# Altium project bms_mainboard-1_0.PrjPcb (part 7 of 7)

## Sheet gnss_quectel_lc29hea.SchDoc
size A
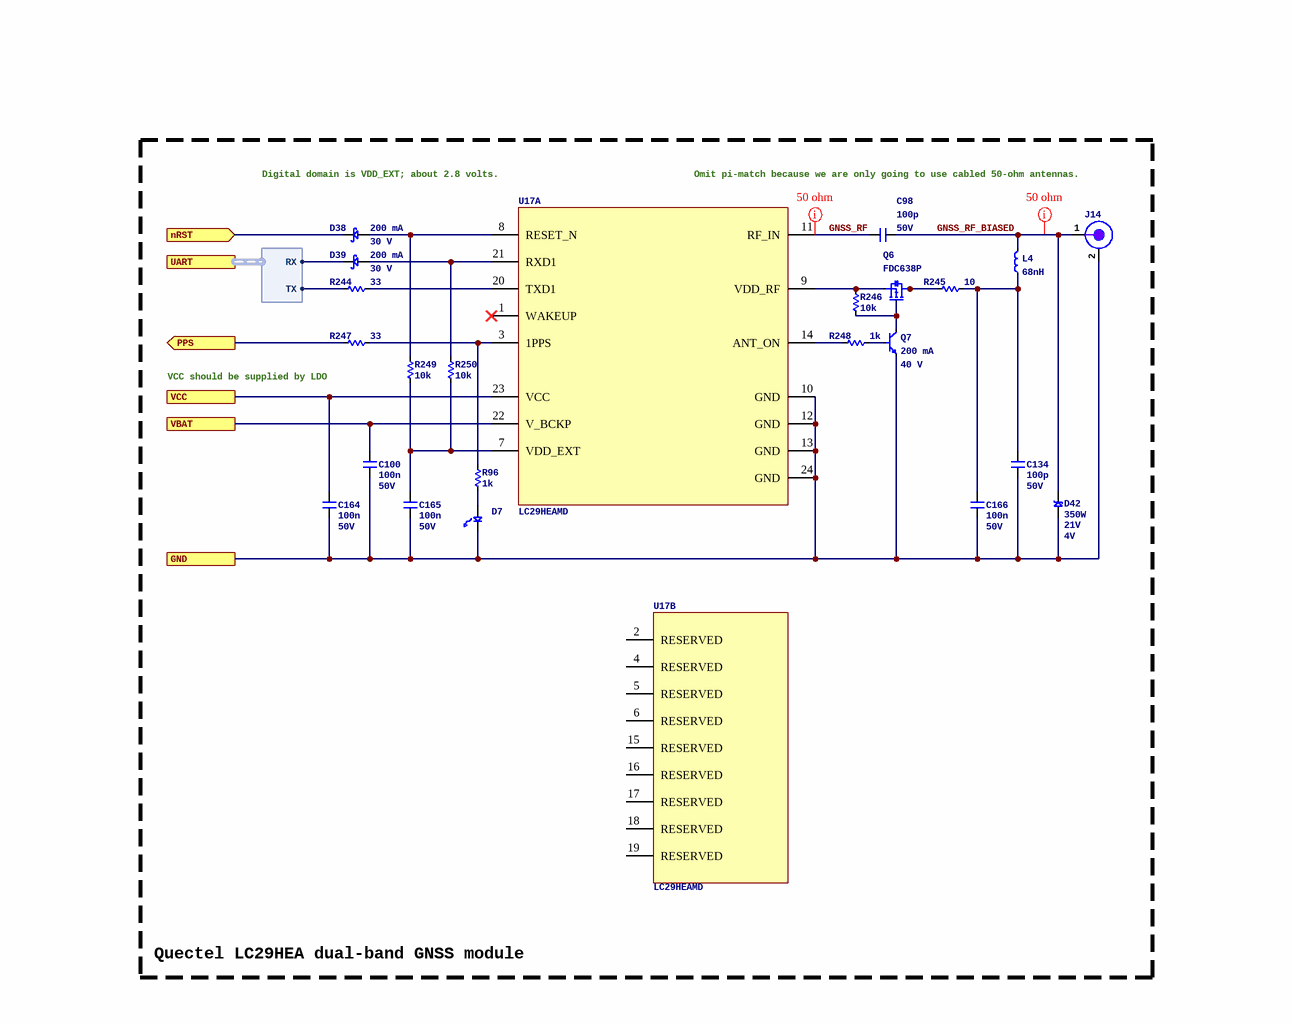
[diagram p32: gnss_quectel_lc29hea.SchDoc]

### Parts
C98  Capacitance: 100p  Voltage Rating: 50V  [C0402]  (hidden comment: 0402CG101J500NT)
C100  Capacitance: 100n  Voltage Rating: 50V  [C0402]  (hidden comment: CL05B104KB54PNC)
C134  Capacitance: 100p  Voltage Rating: 50V  [C0402]  (hidden comment: 0402CG101J500NT)
C164  Capacitance: 100n  Voltage Rating: 50V  [C0402]  (hidden comment: CL05B104KB54PNC)
C165  Capacitance: 100n  Voltage Rating: 50V  [C0402]  (hidden comment: CL05B104KB54PNC)
C166  Capacitance: 100n  Voltage Rating: 50V  [C0402]  (hidden comment: CL05B104KB54PNC)
D7  LTST-C191TBKT  [LED_0603P_BLUE]  (value not drawn)
D38  Current: 200 mA  Voltage: 30 V  [SOD523]  (hidden comment: BAT54XV2T1G)
D39  Current: 200 mA  Voltage: 30 V  [SOD523]  (hidden comment: BAT54XV2T1G)
D42  Non-rep Peak Rev Power Dis-Max: 350W  Clamping Voltage-Max: 21V  Min Breakdown Voltage: 4V  [SOD323]  (hidden comment: PTVSLC3D3V3B)
J14  RFPC-SMA14-FN-A  [GCT_RFPC-SMA14-FN-A]  (value not drawn)
L4  value 68nH  [L0603_0.95MM]  (hidden comment: LQW18AN68NJ80D)
Q6  FDC638P  [6SOT23]
Q7  Current: 200 mA  Voltage: 40 V  [3SOT523]  (hidden comment: MMBT3904T)
R96  value 1k  [R0402]  (hidden comment: 0402WGF1001TCE)
R244  value 33  [R0402]  (hidden comment: 0402WGF330JTCE)
R245  value 10  [R2512]  (hidden comment: RTT2510R0FTE)
R246  value 10k  [R0402]  (hidden comment: 0402WGF1002TCE)
R247  value 33  [R0402]  (hidden comment: 0402WGF330JTCE)
R248  value 1k  [R0402]  (hidden comment: 0402WGF1001TCE)
R249  value 10k  [R0402]  (hidden comment: 0402WGF1002TCE)
R250  value 10k  [R0402]  (hidden comment: 0402WGF1002TCE)
U17  LC29HEAMD  [QUECTEL_LC29H]  (parts A,B of 2)

### Ports
GND, nRST (in), PPS (out), UART (harness UART), VBAT, VCC

### Harnesses
UART: RX, TX

### Nets
GND: C100.2 C134.2 C164.2 C165.2 C166.2 D7.1 D42.1 J14.2(GND) Q7.2(E) U17.10(GND) U17.12(GND) U17.13(GND) U17.24(GND) ; port GND
VBAT: C100.1 U17.22(V_BCKP) ; port VBAT
3P3_GNSS: C164.1 U17.23(VCC) ; port VCC
GNSS_nRST: D38.2 ; port nRST
GNSS_RF: C98.1 U17.11(RF_IN)
GNSS_RF_BIASED: C98.2 D42.2 J14.1(RF) L4.2
TIMEPULSE: R247.2 ; port PPS
UART8.RX: R244.2 ; port UART.TX
UART8.TX: D39.2 ; port UART.RX
NetC134_1: C134.1 C166.1 L4.1 R245.1
NetC165_1: C165.1 R249.2 R250.2 U17.7(VDD_EXT)
NetD7_2: D7.2 R96.2
NetD38_1: D38.1 R249.1 U17.8(RESET_N)
NetD39_1: D39.1 R250.1 U17.21(RXD1)
NetQ6_1: Q6.1 Q6.2 Q6.5 Q6.6 R245.2
NetQ6_3: Q6.3 Q7.3(C) R246.2
NetQ6_4: Q6.4 R246.1 U17.9(VDD_RF)
NetQ7_1: Q7.1(B) R248.1
NetR96_1: R96.1 R247.1 U17.3(1PPS)
NetR244_1: R244.1 U17.20(TXD1)
NetR248_2: R248.2 U17.14(ANT_ON)

Not connected (* = marked no-connect by the designer): U17 1(WAKEUP)* 2(RESERVED) 4(RESERVED) 5(RESERVED) 6(RESERVED) 15(RESERVED) 16(RESERVED) 17(RESERVED) 18(RESERVED) 19(RESERVED)

### Layout directives
net class SE_50: GNSS_RF, GNSS_RF_BIASED

### Notes on the sheet
- Digital domain is VDD_EXT; about 2.8 volts.
- Omit pi-match because we are only going to use cabled 50-ohm antennas.
- (near R247) VCC should be supplied by LDO
- Quectel LC29HEA dual-band GNSS module

### Library data of the parts
C98 C134 = 0402CG101J500NT: Manufacturer: FH(Guangdong Fenghua Advanced Tech); Dielectric: C0G; ComponentLink1URL: https://wmsc.lcsc.com/wmsc/upload/file/pdf/v2/lcsc/2304140030_FH--Guangdong-Fenghua-Advanced-Tech-0402CG101J500NT_C1546.pdf; ComponentLink1Description: Datasheet; Manufacturer Part Number: 0402CG101J500NT; Package: 0402; Supplier 2: LCSC; Supplier Part Number 2: C1546
C100 C164-C166 = CL05B104KB54PNC: Manufacturer: Samsung Electro-Mechanics; Dielectric: X7R; ComponentLink1URL: https://wmsc.lcsc.com/wmsc/upload/file/pdf/v2/lcsc/2304140030_Samsung-Electro-Mechanics-CL05B104KB54PNC_C307331.pdf; ComponentLink1Description: Datasheet; Manufacturer Part Number: CL05B104KB54PNC; Package: 0402; Supplier 2: LCSC; Supplier Part Number 2: C307331
D7 = LED_0603_BLUE_LTST-C191TBKT: LED 468NM BLUE CLEAR 0603 SMD; Manufacturer: Lite-On Inc; Supplier 1: Digikey; Manufacturer Part Number: LTST-C191TBKT; ComponentLink1URL: https://mm.digikey.com/Volume0/opasdata/d220001/medias/docus/1139/LTST-C190AKT.pdf; ComponentLink1Description: Datasheet; Supplier Part Number 1: 160-1647-1-ND; Supplier 2: LCSC; Supplier Part Number 2: C99290
D38 D39 = SCHOTTKY_30V_BAT54XV2T1G: ON Semi BAT54XV2T1G; SMT Schottky Diode; 30V 200mA; 5ns; 2-Pin SOD-523; Manufacturer: onsemi; Supplier 1: DigiKey; Supplier Part Number 1: BAT54XV2T1GOSCT-ND; Manufacturer Part Number: BAT54XV2T1G; Supplier 2: LCSC; Supplier Part Number 2: C81572; ComponentLink1Description: Datasheet; ComponentLink1URL: https://www.onsemi.com/pdf/datasheet/bat54xv2t1-d.pdf
D42 = TVS_UNI_3.3V_PTVSLC3D3V3B: -55℃~+150℃ 1uA 20A@8/20us 21V 3.3V 3.5pF 350W@8/20us 4V Bidirectional IEC 61000-4-2 TVS SOD-323 ESD and Surge Protection (TVS/ESD) ROHS; Manufacturer: Prisemi; Supplier 1: LCSC; Supplier Part Number 1: C246774; Manufacturer Part Number: PTVSLC3D3V3B; ComponentLink1URL: https://mm.digikey.com/Volume0/opasdata/d220001/medias/docus/4180/30KPA_Series.pdf; ComponentLink1Description: Datasheet
J14 = CONN_GCT_SMA_RA_RFPC-SMA14-FN-A: SMA Connector Jack, Female Socket Panel Mount, Through Hole, Right Angle Solder, IP68 unmated; Manufacturer: GCT (Gradconn); Supplier 1: Digikey; Supplier Part Number 1: 2072-RFPC-SMA14-FN-A-ND; Manufacturer Part Number: RFPC-SMA14-FN-A; ComponentLink1Description: Datasheet; ComponentLink1URL: https://www.gradconn.com/Files/Drawings/RFPC-SMA14-FN.pdf; Supplier 2: LCSC; Supplier Part Number 2: C3173272
L4 = IND_0.068UH_LQW18AN68NJ80D: General Purpose Inductor, 0.068uH, 5%, 1 Element, Wirewound-Core, 1608/0603, 2.38GHz self resonant frequency; Manufacturer: Murata; Current: 630mA; Supplier 1: Digikey; Supplier Part Number 1: LQW18AN68NJ80D-ND; Manufacturer Part Number: LQW18AN68NJ80D; Supplier 2: LCSC; Supplier Part Number 2: C269832
Q6 = PFET_20V_FDC638P: MOSFET P-CH 20V 4.5A SSOT-6; Manufacturer: onsemi; Supplier 1: Digikey; ComponentLink1URL: https://www.onsemi.com/pdf/datasheet/fdc638p-d.pdf; ComponentLink1Description: Datasheet; Supplier Part Number 1: FDC638PCT-ND; Manufacturer Part Number: FDC638P; Supplier 2: LCSC; Supplier Part Number 2: C241772
Q7 = NPN_40V_MMBT3904T: Bipolar (BJT) Transistor NPN 40 V 200 mA 300MHz 150 mW Surface Mount SOT-523; Manufacturer: Shenzhen Slkormicro Semicon Co., Ltd.; Supplier 1: Digikey; Supplier Part Number 1: 5399-MMBT3904TCT-ND; Manufacturer Part Number: MMBT3904T; ComponentLink1Description: Datasheet; ComponentLink1URL: https://mm.digikey.com/Volume0/opasdata/d220001/medias/docus/7136/5399_MMBT3904T%20SOT-523.pdf; Supplier 2: LCSC; Supplier Part Number 2: C61616
R96 R248 = 0402WGF1001TCE: Manufacturer: UNI-ROYAL(Uniroyal Elec); Tolerance: 1%; Temperature Coefficient: Â±100ppm/â„ƒ; Power Rating (mW): 62.5; ComponentLink1Description: Datasheet; ComponentLink1URL: https://wmsc.lcsc.com/wmsc/upload/file/pdf/v2/lcsc/2206010216_UNI-ROYAL-Uniroyal-Elec-0402WGF1001TCE_C11702.pdf; Manufacturer Part Number: 0402WGF1001TCE; Package: 0402; Supplier 2: LCSC; Supplier Part Number 2: C11702
R244 R247 = 0402WGF330JTCE: Manufacturer: UNI-ROYAL(Uniroyal Elec); Tolerance: 1%; Temperature Coefficient: Â±100ppm/â„ƒ; Power Rating (mW): 62.5; ComponentLink1Description: Datasheet; ComponentLink1URL: https://wmsc.lcsc.com/wmsc/upload/file/pdf/v2/lcsc/2205311900_UNI-ROYAL-Uniroyal-Elec-0402WGF330JTCE_C25105.pdf; Manufacturer Part Number: 0402WGF330JTCE; Package: 0402; Supplier 2: LCSC; Supplier Part Number 2: C25105
R245 = RTT2510R0FTE: Manufacturer: RALEC; Tolerance: 1%; Temperature Coefficient: Â±100ppm/â„ƒ; Power Rating (mW): 1000; ComponentLink1Description: Datasheet; ComponentLink1URL: https://wmsc.lcsc.com/wmsc/upload/file/pdf/v2/lcsc/2304140030_RALEC-RTT2510R0FTE_C105071.pdf; Manufacturer Part Number: RTT2510R0FTE; Package: 2512; Supplier 2: LCSC; Supplier Part Number 2: C105071
R246 R249 R250 = 0402WGF1002TCE: Manufacturer: UNI-ROYAL(Uniroyal Elec); Tolerance: 1%; Temperature Coefficient: Â±100ppm/â„ƒ; Power Rating (mW): 62.5; ComponentLink1Description: Datasheet; ComponentLink1URL: https://wmsc.lcsc.com/wmsc/upload/file/pdf/v2/lcsc/2206010100_UNI-ROYAL-Uniroyal-Elec-0402WGF1002TCE_C25744.pdf; Manufacturer Part Number: 0402WGF1002TCE; Package: 0402; Supplier 2: LCSC; Supplier Part Number 2: C25744
U17 = GNSS_QUECTEL_LC29HEAMD: Rf Txrx Module Navigation SMD; Supplier: DigiKey; Supplier Part Number: 2958-LC29HEAMDCT-ND; Manufacturer: Quectel; Manufacturer Part Number: LC29HEAMD; Category: RF Transceiver Modules and Modems; Stock: 95; Pricing: 1=41.12, 10=35.985, 25=34.2064, 100=31.769 (USD)

## Nets that join several sheets
1P2: top (TP37.1), pmic_tps65263_buck (C31.1 L3.2 R86.2), eth_ksz8567r_switch (17 pins)
3P3: top (TP35.1), bridge_bq79600 (C171.1 R288.2 R289.2 U22.3), mcu_stm32f4 (46 pins), pmic_tps65263_buck (C28.1 L2.2 R71.2 U2.5), conn_fan (R114.1 R115.1), conn_harness_lv/can1 (C102A.1 U10A.5), conn_harness_lv/can0 (C102B.1 U10B.5), eth_ksz8567r_switch (20 pins), conn_harness_lv/lv_switch0 (R219A.1), conn_harness_lv/lv_switch1 (R219B.1), conn_harness_lv/lv_switch2 (R219C.1), conn_harness_lv/sensor0 (D34A.2), conn_harness_lv/sensor1 (D34B.2), conn_harness_lv/digital0 (D43A.2 R264A.2 R265A.2), conn_harness_lv/digital1 (D43B.2 R264B.2 R265B.2), conn_harness_lv/digital2 (D43C.2 R264C.2 R265C.2), conn_harness_lv/digital3 (D43D.2 R264D.2 R265D.2), eth_10base-t1s_phy (8 pins), isolator_si8662 (C158.1 U14.1), imu_ism330 (FB16.1), dht_bme280 (5 pins)
3P3_B: adc_mcp3913 (6 pins), isolator_si8662 (C159.1 C162.1 U14.16 U16.5)
3P3_USB: top (TP90.1), usb_usb2534 (12 pins), st-link-v2 (14 pins), pmic_tps79933 (C198A.1 U20A.5)
5P0: top (TP33.1), bridge_bq79600 (5 pins), pmic_tps65263_buck (8 pins), conn_usbc (D16.1), conn_harness_lv/can1 (C101A.1 U10A.3), conn_harness_lv/can0 (C101B.1 U10B.3), conn_harness_lv/sensor0 (FB12A.1), conn_harness_lv/sensor1 (FB12B.1), isolator_si8662 (U15.2), pmic_tps79933 (C197B.1 U20B.1 U20B.3)
CHASSIS: top (9 pins), pmic_vicor_brick (10 pins), conn_harness_lv (J12.11), eth_ksz8567r_switch (J8.SH), conn_harness_lv/ethernet_switch/mag0 (C49A.2), conn_harness_lv/ethernet_switch/mag1 (C49B.2), conn_harness_lv/ethernet_switch/mag2 (C49C.2)
GND: top (8 pins), conn_isouart (C177.2 C178.2 C179.2 D2.3), bridge_bq79600 (9 pins), mcu_stm32f4 (67 pins), pmic_tps65263_buck (28 pins), conn_fan (J9.1 J9.5 Q4.2 Q5.2), hv_bleed (K4.2), current_coil_hs (12 pins), current_coil_ls (12 pins), current_coil_pc (12 pins), pmic_vicor_brick (5 pins), usb_usb2534 (16 pins), conn_usbc (6 pins), st-link-v2 (24 pins), conn_harness_lv (23 pins), conn_harness_lv/can1 (6 pins), conn_harness_lv/can0 (6 pins), eth_ksz8567r_switch (44 pins), conn_harness_lv/ethernet_switch/mag0 (C47A.2 C50A.2), conn_harness_lv/ethernet_switch/mag1 (C47B.2 C50B.2), conn_harness_lv/ethernet_switch/mag2 (C47C.2 C50C.2), conn_harness_lv/lv_switch0 (13 pins), conn_harness_lv/lv_switch1 (13 pins), conn_harness_lv/lv_switch2 (13 pins), conn_harness_lv/sensor0 (C148A.2 C149A.2 D34A.1 R218A.1), conn_harness_lv/sensor1 (C148B.2 C149B.2 D34B.1 R218B.1), conn_harness_lv/digital0 (C188A.2 D43A.1 Q11A.2), conn_harness_lv/digital1 (C188B.2 D43B.1 Q11B.2), conn_harness_lv/digital2 (C188C.2 D43C.1 Q11C.2), conn_harness_lv/digital3 (C188D.2 D43D.1 Q11D.2), eth_10base-t1s_phy (22 pins), isolator_si8662 (C158.2 U14.8 U15.1), pmic_tps79933 (C197A.2 C198A.2 C199A.2), imu_ism330 (7 pins), dht_bme280 (5 pins), gnss_quectel_lc29hea (13 pins), pmic_tps79933 (C197B.2 C198B.2 C199B.2)
HV_N: adc_mcp3913 (8 pins), hv_architecture (8 pins), hv_bleed (D9.1 K4.5), pmic_vicor_brick (R160.1), isolator_si8662 (8 pins)
HV_P: hv_architecture (F3.2 R85.1), hv_bleed (D18.2 R112.2), pmic_vicor_brick (C58.1 C60.1 C99.1 H7.1)
LV_COIL: top (TP34.1), current_coil_hs (C81A.2 C83A.2 U8A.2 U8A.11), current_coil_ls (C81B.2 C83B.2 U8B.2 U8B.11), current_coil_pc (C81C.2 C83C.2 U8C.2 U8C.11), conn_harness_lv/lv_switch1 (C157B.1 U13B.21 U13B.22)
LV_FAN: top (TP36.1), conn_fan (J9.2 J9.6 R116.1 R117.1), conn_harness_lv/lv_switch1 (C156B.1 U13B.25 U13B.26)
LVB: top (TP32.1), pmic_tps65263_buck (D6.1), pmic_vicor_brick (D23.2 R108.2), conn_harness_lv (D12.2 XF6.2), conn_harness_lv/lv_switch0 (6 pins), conn_harness_lv/lv_switch1 (6 pins), conn_harness_lv/lv_switch2 (6 pins)
VBAT: top (BT1.1), mcu_stm32f4 (C7.1 U1.C1), gnss_quectel_lc29hea (C100.1 U17.22)
VBUS: top (TP89.1), usb_usb2534 (R267.1), conn_usbc (C80.1 D16.2 J11.VBUS), st-link-v2 (R201.1), pmic_tps79933 (C197A.1 U20A.1 U20A.3)
3P3_GNSS: gnss_quectel_lc29hea (C164.1 U17.23), pmic_tps79933 (C198B.1 U20B.5)
10B-T1S_MDI._N: conn_harness_lv (J13.22), eth_10base-t1s_phy (C89.2 R235.1 R237.1)
10B-T1S_MDI._P: conn_harness_lv (J13.21), eth_10base-t1s_phy (C88.2 R236.1 R238.1)
AIN0: mcu_stm32f4 (U1.R2), conn_harness_lv/sensor0 (C149A.1 D34A.3 R217A.1 R218A.2)
AIN1: mcu_stm32f4 (U1.P3), conn_harness_lv/sensor1 (C149B.1 D34B.3 R217B.1 R218B.2)
ARRAY_IS._N: adc_mcp3913/shunt3 (R107D.2), hv_architecture (R90.3)
ARRAY_IS._P: adc_mcp3913/shunt3 (R104D.2), hv_architecture (R90.4)
BATT_IS._N: adc_mcp3913/shunt2 (R107C.2), hv_architecture (R89.4)
BATT_IS._P: adc_mcp3913/shunt2 (R104C.2), hv_architecture (R89.3)
CAN1.RX: mcu_stm32f4 (U1.B12), conn_harness_lv/can0 (U10B.4)
CAN1.TX: mcu_stm32f4 (R1.1), conn_harness_lv/can0 (R161B.1)
CAN1_MDI._N: conn_harness_lv (J12.21), conn_harness_lv/can0 (T3B.4)
CAN1_MDI._P: conn_harness_lv (J12.22), conn_harness_lv/can0 (T3B.3)
CAN2.RX: mcu_stm32f4 (U1.A8), conn_harness_lv/can1 (U10A.4)
CAN2.TX: mcu_stm32f4 (R33.1), conn_harness_lv/can1 (R161A.1)
CAN2_MDI._N: conn_harness_lv (J13.33), conn_harness_lv/can1 (T3A.4)
CAN2_MDI._P: conn_harness_lv (J13.34), conn_harness_lv/can1 (T3A.3)
CH0._N: adc_mcp3913 (U3.3), adc_mcp3913/shunt0 (C52A.2 C57A.2 R107A.1)
CH0._P: adc_mcp3913 (U3.2), adc_mcp3913/shunt0 (C52A.1 C54A.1 R104A.1)
CH1._N: adc_mcp3913 (U3.4), adc_mcp3913/shunt1 (C52B.2 C57B.2 R107B.1)
CH1._P: adc_mcp3913 (U3.5), adc_mcp3913/shunt1 (C52B.1 C54B.1 R104B.1)
CH2._N: adc_mcp3913 (U3.7), adc_mcp3913/shunt2 (C52C.2 C57C.2 R107C.1)
CH2._P: adc_mcp3913 (U3.6), adc_mcp3913/shunt2 (C52C.1 C54C.1 R104C.1)
CH3._N: adc_mcp3913 (TP72.1 U3.8), adc_mcp3913/shunt3 (C52D.2 C57D.2 R107D.1)
CH3._P: adc_mcp3913 (TP71.1 U3.9), adc_mcp3913/shunt3 (C52D.1 C54D.1 R104D.1)
CH4._N: adc_mcp3913 (U3.11), adc_mcp3913/shunt4 (C52E.2 C57E.2 R107E.1)
CH4._P: adc_mcp3913 (U3.10), adc_mcp3913/shunt4 (C52E.1 C54E.1 R104E.1)
CH5._N: adc_mcp3913 (U3.12), adc_mcp3913/shunt5 (C52F.2 C57F.2 R107F.1)
CH5._P: adc_mcp3913 (U3.13), adc_mcp3913/shunt5 (C52F.1 C54F.1 R104F.1)
COIL_HS._N: hv_architecture (K1.1), current_coil_hs (C84A.1 D21A.1 U8A.3)
COIL_HS._P: hv_architecture (K1.2), current_coil_hs (C82A.2 D20A.1 U8A.10)
COIL_LS._N: hv_architecture (K3.1), current_coil_ls (C84B.1 D21B.1 U8B.3)
COIL_LS._P: hv_architecture (K3.2), current_coil_ls (C82B.2 D20B.1 U8B.10)
COIL_PC._N: hv_architecture (K2.4), current_coil_pc (C84C.1 D21C.1 U8C.3)
COIL_PC._P: hv_architecture (K2.1), current_coil_pc (C82C.2 D20C.1 U8C.10)
DCDC_IS._N: adc_mcp3913/shunt0 (R107A.2), pmic_vicor_brick (R160.3)
DCDC_IS._P: adc_mcp3913/shunt0 (R104A.2), pmic_vicor_brick (R160.4)
DIN0: mcu_stm32f4 (U1.N12), conn_harness_lv/digital0 (Q11A.3 R264A.1)
DIN1: mcu_stm32f4 (U1.N11), conn_harness_lv/digital1 (Q11B.3 R264B.1)
DIN2: mcu_stm32f4 (U1.J14), conn_harness_lv/digital2 (Q11C.3 R264C.1)
DIN3: mcu_stm32f4 (U1.J15), conn_harness_lv/digital3 (Q11D.3 R264D.1)
EDISC_A: pmic_tps65263_buck (R59.1), conn_harness_lv (J12.7)
EDISC_B: pmic_tps65263_buck (R61.1), conn_harness_lv (J12.8)
ETH_P1.RX_N: conn_harness_lv (J13.27), conn_harness_lv/ethernet_switch/mag0 (T1A.14)
ETH_P1.RX_P: conn_harness_lv (J13.28), conn_harness_lv/ethernet_switch/mag0 (T1A.16)
ETH_P1.TX_N: conn_harness_lv (J13.25), conn_harness_lv/ethernet_switch/mag0 (T1A.11)
ETH_P1.TX_P: conn_harness_lv (J13.26), conn_harness_lv/ethernet_switch/mag0 (T1A.9)
ETH_P2.RX_N: conn_harness_lv (J12.27), conn_harness_lv/ethernet_switch/mag1 (T1B.14)
ETH_P2.RX_P: conn_harness_lv (J12.28), conn_harness_lv/ethernet_switch/mag1 (T1B.16)
ETH_P2.TX_N: conn_harness_lv (J12.25), conn_harness_lv/ethernet_switch/mag1 (T1B.11)
ETH_P2.TX_P: conn_harness_lv (J12.26), conn_harness_lv/ethernet_switch/mag1 (T1B.9)
ETH_P3.RX_N: conn_harness_lv (J12.33), conn_harness_lv/ethernet_switch/mag2 (T1C.14)
ETH_P3.RX_P: conn_harness_lv (J12.34), conn_harness_lv/ethernet_switch/mag2 (T1C.16)
ETH_P3.TX_N: conn_harness_lv (J12.31), conn_harness_lv/ethernet_switch/mag2 (T1C.11)
ETH_P3.TX_P: conn_harness_lv (J12.32), conn_harness_lv/ethernet_switch/mag2 (T1C.9)
ETH_REFCLK: mcu_stm32f4 (U1.N2), eth_ksz8567r_switch (R173.1)
ETH_SWITCH_nINT: mcu_stm32f4 (U1.N10), eth_ksz8567r_switch (R286.2)
ETH_SWITCH_nRST: mcu_stm32f4 (R287.1), eth_ksz8567r_switch (C137.1 R188.2 U11.96)
ETH_SWITCH_nSS3: mcu_stm32f4 (R45.1), eth_ksz8567r_switch (U11.100)
ETH_SWITCH_SYNCLKO: mcu_stm32f4 (U1.R15), eth_ksz8567r_switch (R285.1)
FAN1_PWM: mcu_stm32f4 (R31.1), conn_fan (R119.2)
FAN1_TACH: mcu_stm32f4 (U1.B1), conn_fan (D10.1 R115.2)
FAN2_PWM: mcu_stm32f4 (R34.1), conn_fan (R118.2)
FAN2_TACH: mcu_stm32f4 (U1.B2), conn_fan (D14.1 R114.2)
GNSS_nRST: mcu_stm32f4 (R259.1), gnss_quectel_lc29hea (D38.2)
HS_CONTACTOR: mcu_stm32f4 (R15.1), current_coil_hs (R140A.2 R143A.1 U8A.15)
HV_BUCK_EN: mcu_stm32f4 (R5.1), pmic_vicor_brick (R155.2 R156.1)
HV_nBLEED: mcu_stm32f4 (R4.1), hv_bleed (R132.2)
HV_VS._N: adc_mcp3913/shunt1 (R107B.2), hv_architecture (R88.1)
HV_VS._P: adc_mcp3913/shunt1 (R104B.2), hv_architecture (R85.2 R87.1)
I2C1.SCL: mcu_stm32f4 (R36.1), dht_bme280 (U9.4)
I2C1.SDA: mcu_stm32f4 (R35.1 R54.1), dht_bme280 (R243.1)
IMU_INT1: mcu_stm32f4 (U1.D9), imu_ism330 (R283.1)
IMU_INT2: mcu_stm32f4 (U1.C8), imu_ism330 (R284.2)
ISOUART._N: conn_isouart (C179.1 R292.1 R293.1), bridge_bq79600 (U22.11)
ISOUART._P: conn_isouart (C178.1 R291.1 R292.2), bridge_bq79600 (U22.10)
LS_CONTACTOR: mcu_stm32f4 (R16.1), current_coil_ls (R140B.2 R143B.1 U8B.15)
LV_nSS0: mcu_stm32f4 (R260.1), conn_harness_lv/lv_switch0 (R224A.2)
LV_nSS1: mcu_stm32f4 (R261.1), conn_harness_lv/lv_switch1 (R224B.2)
LV_nSS2: mcu_stm32f4 (R262.1), conn_harness_lv/lv_switch2 (R224C.2)
LV_PWM_CLK: mcu_stm32f4 (R9.1), conn_harness_lv/lv_switch0 (R223A.2), conn_harness_lv/lv_switch1 (R223B.2), conn_harness_lv/lv_switch2 (R223C.2)
MC0_IS._N: adc_mcp3913/shunt4 (R107E.2), hv_architecture (R80.4)
MC0_IS._P: adc_mcp3913/shunt4 (R104E.2), hv_architecture (R80.3)
MC1_IS._N: adc_mcp3913/shunt5 (R107F.2), hv_architecture (R83.3)
MC1_IS._P: adc_mcp3913/shunt5 (R104F.2), hv_architecture (R83.4)
MCP3913_nDR: mcu_stm32f4 (U1.C2), isolator_si8662 (R233.2)
MCP3913_nDR_ISO: adc_mcp3913 (R75.1 U3.18), isolator_si8662 (U14.11)
MCP3913_nRST: mcu_stm32f4 (R28.1), isolator_si8662 (U14.5)
MCP3913_nRST_ISO: adc_mcp3913 (C34.1 R76.1 U3.27), isolator_si8662 (R228.1)
MCU_nRST: mcu_stm32f4 (C14.1 R30.2 R32.1 U1.J1), st-link-v2 (U12.18)
MCU_RMII.CRS_DV: mcu_stm32f4 (U1.R3), eth_ksz8567r_switch (R174.1)
MCU_RMII.RXD0: mcu_stm32f4 (U1.N5), eth_ksz8567r_switch (R175.1 R176.2)
MCU_RMII.RXD1: mcu_stm32f4 (U1.P5), eth_ksz8567r_switch (R178.1)
MCU_RMII.TX_EN: mcu_stm32f4 (R38.1), eth_ksz8567r_switch (U11.49)
MCU_RMII.TXD0: mcu_stm32f4 (R40.1), eth_ksz8567r_switch (U11.55)
MCU_RMII.TXD1: mcu_stm32f4 (R41.1), eth_ksz8567r_switch (U11.54)
MII_P7.COL: eth_ksz8567r_switch (U11.69), eth_10base-t1s_phy (R192.2)
MII_P7.CRS: eth_ksz8567r_switch (U11.79), eth_10base-t1s_phy (R191.2 R239.1)
MII_P7.RX_CLK: eth_ksz8567r_switch (U11.66), eth_10base-t1s_phy (R150.2)
MII_P7.RX_DV: eth_ksz8567r_switch (U11.67), eth_10base-t1s_phy (R149.2 R187.1)
MII_P7.RX_ER: eth_ksz8567r_switch (U11.68), eth_10base-t1s_phy (R172.2 R177.1)
MII_P7.RXD0: eth_ksz8567r_switch (U11.73), eth_10base-t1s_phy (R151.2 R185.1)
MII_P7.RXD1: eth_ksz8567r_switch (U11.72), eth_10base-t1s_phy (R153.2 R184.1)
MII_P7.RXD2: eth_ksz8567r_switch (U11.71), eth_10base-t1s_phy (R146.2 R157.2)
MII_P7.RXD3: eth_ksz8567r_switch (U11.70), eth_10base-t1s_phy (R158.2 R183.1)
MII_P7.TX_CLK: eth_ksz8567r_switch (U11.75), eth_10base-t1s_phy (R190.2)
MII_P7.TX_EN: eth_ksz8567r_switch (R103.1), eth_10base-t1s_phy (U7.7)
MII_P7.TX_ER: eth_ksz8567r_switch (R120.1), eth_10base-t1s_phy (U7.11)
MII_P7.TXD0: eth_ksz8567r_switch (R121.1 R122.2), eth_10base-t1s_phy (U7.6)
MII_P7.TXD1: eth_ksz8567r_switch (R123.1 R124.2), eth_10base-t1s_phy (U7.5)
MII_P7.TXD2: eth_ksz8567r_switch (R125.1 R130.2), eth_10base-t1s_phy (U7.4)
MII_P7.TXD3: eth_ksz8567r_switch (R131.1 R133.2), eth_10base-t1s_phy (U7.3)
NetC37_2: adc_mcp3913 (6 pins), adc_mcp3913/shunt0 (C54A.2 C57A.1), adc_mcp3913/shunt1 (C54B.2 C57B.1), adc_mcp3913/shunt2 (C54C.2 C57C.1), adc_mcp3913/shunt3 (C54D.2 C57D.1), adc_mcp3913/shunt4 (C54E.2 C57E.1), adc_mcp3913/shunt5 (C54F.2 C57F.1)
NetC148A_1: conn_harness_lv (J12.3), conn_harness_lv/sensor0 (C148A.1 FB12A.2)
NetC148B_1: conn_harness_lv (J12.6), conn_harness_lv/sensor1 (C148B.1 FB12B.2)
NetC150A_1: conn_harness_lv (J12.13), conn_harness_lv/lv_switch0 (C150A.1 U13A.3 U13A.4)
NetC150B_1: conn_harness_lv (J13.16), conn_harness_lv/lv_switch1 (C150B.1 U13B.3 U13B.4)
NetC150C_1: conn_harness_lv (J13.35), conn_harness_lv/lv_switch2 (C150C.1 U13C.3 U13C.4)
NetC151A_1: conn_harness_lv (J12.24), conn_harness_lv/lv_switch0 (C151A.1 U13A.31 U13A.32)
NetC151B_1: conn_harness_lv (J13.3), conn_harness_lv/lv_switch1 (C151B.1 U13B.31 U13B.32)
NetC151C_1: conn_harness_lv (J13.30), conn_harness_lv/lv_switch2 (C151C.1 U13C.31 U13C.32)
NetC154A_1: conn_harness_lv (J12.15), conn_harness_lv/lv_switch0 (C154A.1 U13A.29 U13A.30)
NetC154B_1: conn_harness_lv (J13.1), conn_harness_lv/lv_switch1 (C154B.1 U13B.29 U13B.30)
NetC154C_1: conn_harness_lv (J13.19), conn_harness_lv/lv_switch2 (C154C.1 U13C.29 U13C.30)
NetC155A_1: conn_harness_lv (J12.17), conn_harness_lv/lv_switch0 (C155A.1 U13A.27 U13A.28)
NetC155B_1: conn_harness_lv (J13.24), conn_harness_lv/lv_switch1 (C155B.1 U13B.27 U13B.28)
NetC155C_1: conn_harness_lv (J13.7), conn_harness_lv/lv_switch2 (C155C.1 U13C.27 U13C.28)
NetC156A_1: conn_harness_lv (J12.23), conn_harness_lv/lv_switch0 (C156A.1 U13A.25 U13A.26)
NetC156C_1: conn_harness_lv (J13.18), conn_harness_lv/lv_switch2 (C156C.1 U13C.25 U13C.26)
NetC157A_1: conn_harness_lv (J12.35), conn_harness_lv/lv_switch0 (C157A.1 U13A.21 U13A.22)
NetC157C_1: conn_harness_lv (J13.5), conn_harness_lv/lv_switch2 (C157C.1 U13C.21 U13C.22)
NetJ12_2: conn_harness_lv (J12.2), conn_harness_lv/sensor0 (R217A.2)
NetJ12_5: conn_harness_lv (J12.5), conn_harness_lv/sensor1 (R217B.2)
NetJ12_9: conn_harness_lv (J12.9), conn_harness_lv/digital1 (R266B.1)
NetJ12_19: conn_harness_lv (J12.19), conn_harness_lv/digital0 (R266A.1)
NetJ13_13: conn_harness_lv (J13.13), conn_harness_lv/digital2 (R266C.1)
NetJ13_15: conn_harness_lv (J13.15), conn_harness_lv/digital3 (R266D.1)
P1_MDI_PHY.RX_N: eth_ksz8567r_switch (U11.5), conn_harness_lv/ethernet_switch/mag0 (T1A.3)
P1_MDI_PHY.RX_P: eth_ksz8567r_switch (U11.4), conn_harness_lv/ethernet_switch/mag0 (T1A.1)
P1_MDI_PHY.TX_N: eth_ksz8567r_switch (U11.2), conn_harness_lv/ethernet_switch/mag0 (T1A.6)
P1_MDI_PHY.TX_P: eth_ksz8567r_switch (U11.1), conn_harness_lv/ethernet_switch/mag0 (T1A.8)
P2_MDI_PHY.RX_N: eth_ksz8567r_switch (U11.16), conn_harness_lv/ethernet_switch/mag1 (T1B.3)
P2_MDI_PHY.RX_P: eth_ksz8567r_switch (U11.15), conn_harness_lv/ethernet_switch/mag1 (T1B.1)
P2_MDI_PHY.TX_N: eth_ksz8567r_switch (U11.13), conn_harness_lv/ethernet_switch/mag1 (T1B.6)
P2_MDI_PHY.TX_P: eth_ksz8567r_switch (U11.12), conn_harness_lv/ethernet_switch/mag1 (T1B.8)
P3_MDI_PHY.RX_N: eth_ksz8567r_switch (U11.27), conn_harness_lv/ethernet_switch/mag2 (T1C.3)
P3_MDI_PHY.RX_P: eth_ksz8567r_switch (U11.26), conn_harness_lv/ethernet_switch/mag2 (T1C.1)
P3_MDI_PHY.TX_N: eth_ksz8567r_switch (U11.25), conn_harness_lv/ethernet_switch/mag2 (T1C.6)
P3_MDI_PHY.TX_P: eth_ksz8567r_switch (U11.24), conn_harness_lv/ethernet_switch/mag2 (T1C.8)
PC_RELAY: mcu_stm32f4 (R17.1), current_coil_pc (R140C.2 R143C.1 U8C.15)
PHY_GPIO0: mcu_stm32f4 (R53.1), eth_10base-t1s_phy (R152.2)
PHY_nIRQ: mcu_stm32f4 (U1.J4), eth_10base-t1s_phy (R147.2 U7.22)
PHY_nRESET: mcu_stm32f4 (R46.1), eth_10base-t1s_phy (C77.1 R148.2 U7.10)
PMIC_EN_DETECT: mcu_stm32f4 (U1.M12), pmic_tps65263_buck (R63.1)
PMIC_FORCE_EN: mcu_stm32f4 (R6.1), pmic_tps65263_buck (D3.1)
SMI.MDC: mcu_stm32f4 (R95.1), eth_10base-t1s_phy (U7.13)
SMI.MDIO: mcu_stm32f4 (R52.1 U1.P2), eth_10base-t1s_phy (R159.2)
SPI2.MISO: mcu_stm32f4 (U1.C14), eth_ksz8567r_switch (R134.2), conn_harness_lv/lv_switch0 (D36A.2 R227A.1), conn_harness_lv/lv_switch1 (D36B.2 R227B.1), conn_harness_lv/lv_switch2 (D36C.2 R227C.1)
SPI2.MOSI: mcu_stm32f4 (R44.1), eth_ksz8567r_switch (U11.98), conn_harness_lv/lv_switch0 (R226A.2), conn_harness_lv/lv_switch1 (R226B.2), conn_harness_lv/lv_switch2 (R226C.2)
SPI2.SCK: mcu_stm32f4 (R3.1), eth_ksz8567r_switch (U11.101), conn_harness_lv/lv_switch0 (R225A.2), conn_harness_lv/lv_switch1 (R225B.2), conn_harness_lv/lv_switch2 (R225C.2)
SPI4.MISO: mcu_stm32f4 (U1.R12), isolator_si8662 (R232.2)
SPI4.MOSI: mcu_stm32f4 (R43.1), isolator_si8662 (U14.4)
SPI4.SCK: mcu_stm32f4 (R25.1), isolator_si8662 (U14.3)
SPI4_ISO.MISO: adc_mcp3913 (R74.2), isolator_si8662 (U14.10)
SPI4_ISO.MOSI: adc_mcp3913 (U3.26), isolator_si8662 (R231.1)
SPI4_ISO.SCK: adc_mcp3913 (U3.24), isolator_si8662 (R230.1)
SPI4_nSS: mcu_stm32f4 (R29.1), isolator_si8662 (U14.2)
SPI4_nSS_ISO: adc_mcp3913 (U3.23), isolator_si8662 (R229.1)
SPI6.MISO: mcu_stm32f4 (U1.C7), imu_ism330 (R282.1)
SPI6.MOSI: mcu_stm32f4 (R23.1), imu_ism330 (U21.14)
SPI6.SCK: mcu_stm32f4 (R19.1), imu_ism330 (U21.13)
SPI6_nSS: mcu_stm32f4 (R18.1), imu_ism330 (U21.12)
SWD.SWCLK: mcu_stm32f4 (R26.1 U1.A14), st-link-v2 (R197.1 R213.1)
SWD.SWDIO: mcu_stm32f4 (R22.1 U1.A15), st-link-v2 (R212.1 R214.1)
SWD.SWO: mcu_stm32f4 (R56.1 U1.A10), st-link-v2 (U12.31)
TIMEPULSE: mcu_stm32f4 (U1.R14), eth_ksz8567r_switch (U11.90), gnss_quectel_lc29hea (R247.2)
UART7.RX: mcu_stm32f4 (U1.R8), st-link-v2 (R196.1)
UART7.TX: mcu_stm32f4 (R37.1), st-link-v2 (U12.13)
UART8.RX: mcu_stm32f4 (U1.A6), gnss_quectel_lc29hea (R244.2)
UART8.TX: mcu_stm32f4 (R21.1), gnss_quectel_lc29hea (D39.2)
USART2.RX: bridge_bq79600 (R290.2), mcu_stm32f4 (U1.B11)
USART2.TX: bridge_bq79600 (R288.1 U22.4), mcu_stm32f4 (R294.1)
USB_DFP1._N: mcu_stm32f4 (U1.C15), usb_usb2534 (U19.1)
USB_DFP1._P: mcu_stm32f4 (U1.B15), usb_usb2534 (U19.2)
USB_DFP2._N: usb_usb2534 (U19.3), st-link-v2 (U12.32)
USB_DFP2._P: usb_usb2534 (U19.4), st-link-v2 (R204.2 U12.33)
USB_UFP._N: usb_usb2534 (U19.30), conn_usbc (D17.1 R129.1)
USB_UFP._P: usb_usb2534 (U19.31), conn_usbc (D17.2 R128.1)

## Assembly variants
0: not fitted R216